# Altium schematic sheet Sheet1.SchDoc
size A4
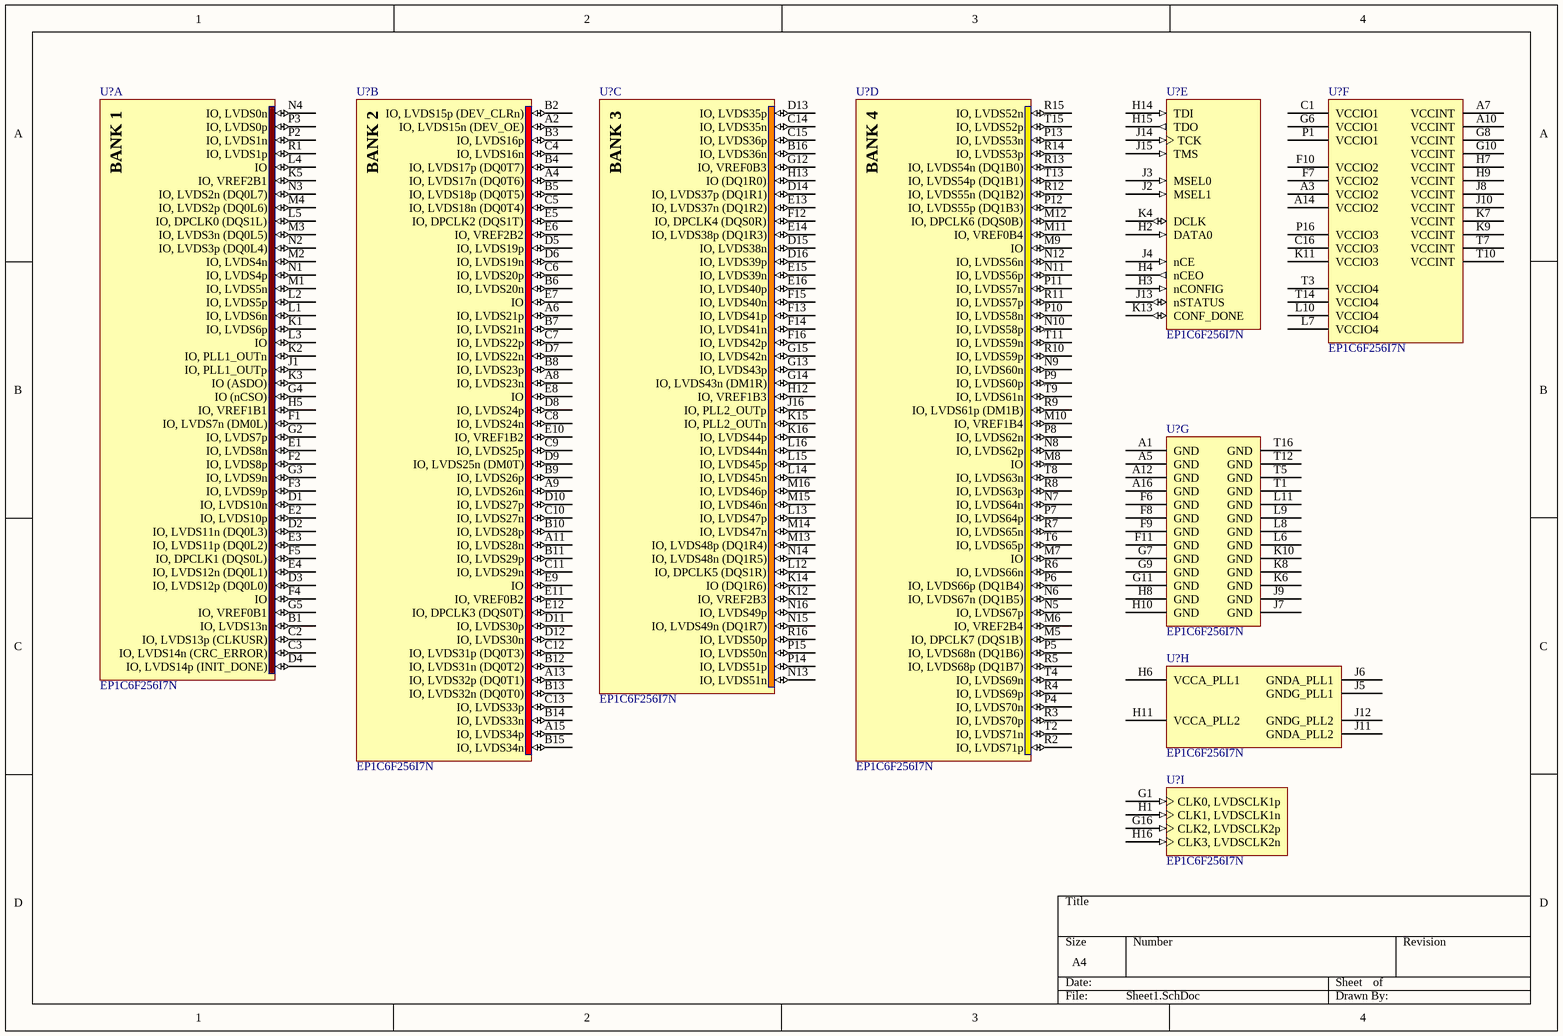
[diagram p0: Sheet1.SchDoc]

## Parts
(Parts that share a designator on the sheet are numbered #1, #2 ... from top to bottom, then left to right.)
U?#1  EP1C6F256I7N  [FBGA256]  (part A of 9)
U?#2  EP1C6F256I7N  [FBGA256]  (part B of 9)
U?#3  EP1C6F256I7N  [FBGA256]  (part C of 9)
U?#4  EP1C6F256I7N  [FBGA256]  (part D of 9)
U?#5  EP1C6F256I7N  [FBGA256]  (part E of 9)
U?#6  EP1C6F256I7N  [FBGA256]  (part F of 9)
U?#7  EP1C6F256I7N  [FBGA256]  (part G of 9)
U?#8  EP1C6F256I7N  [FBGA256]  (part H of 9)
U?#9  EP1C6F256I7N  [FBGA256]  (part I of 9)

## Nets

Not connected (* = marked no-connect by the designer): U?#1 B1(IO,_LVDS13n) C2(IO,_LVDS13p_(CLKUSR)) C3(IO,_LVDS14n_(CRC_ERROR)) D1(IO,_LVDS10n) D2(IO,_LVDS11n_(DQ0L3)) D3(IO,_LVDS12p_(DQ0L0)) D4(IO,_LVDS14p_(INIT_DONE)) E1(IO,_LVDS8n) E2(IO,_LVDS10p) E3(IO,_LVDS11p_(DQ0L2)) E4(IO,_LVDS12n_(DQ0L1)) F1(IO,_LVDS7n_(DM0L)) F2(IO,_LVDS8p) F3(IO,_LVDS9p) F4(IO) F5(IO,_DPCLK1_(DQS0L)) G2(IO,_LVDS7p) G3(IO,_LVDS9n) G4(IO_(nCSO)) G5(IO,_VREF0B1) H5(IO,_VREF1B1) J1(IO,_PLL1_OUTp) K1(IO,_LVDS6p) K2(IO,_PLL1_OUTn) K3(IO_(ASDO)) K5(IO,_VREF2B1) L1(IO,_LVDS6n) L2(IO,_LVDS5p) L3(IO) L4(IO) L5(IO,_DPCLK0_(DQS1L)) M1(IO,_LVDS5n) M2(IO,_LVDS4n) M3(IO,_LVDS3n_(DQ0L5)) M4(IO,_LVDS2p_(DQ0L6)) N1(IO,_LVDS4p) N2(IO,_LVDS3p_(DQ0L4)) N3(IO,_LVDS2n_(DQ0L7)) N4(IO,_LVDS0n) P2(IO,_LVDS1n) P3(IO,_LVDS0p) R1(IO,_LVDS1p); U?#2 A2(IO,_LVDS15n_(DEV_OE)) A4(IO,_LVDS17n_(DQ0T6)) A6(IO,_LVDS21p) A8(IO,_LVDS23n) A9(IO,_LVDS26n) A11(IO,_LVDS28n) A13(IO,_LVDS32p_(DQ0T1)) A15(IO,_LVDS34p) B2(IO,_LVDS15p_(DEV_CLRn)) B3(IO,_LVDS16p) B4(IO,_LVDS17p_(DQ0T7)) B5(IO,_LVDS18p_(DQ0T5)) B6(IO,_LVDS20n) B7(IO,_LVDS21n) B8(IO,_LVDS23p) B9(IO,_LVDS26p) B10(IO,_LVDS28p) B11(IO,_LVDS29p) B12(IO,_LVDS31n_(DQ0T2)) B13(IO,_LVDS32n_(DQ0T0)) B14(IO,_LVDS33n) B15(IO,_LVDS34n) C4(IO,_LVDS16n) C5(IO,_LVDS18n_(DQ0T4)) C6(IO,_LVDS20p) C7(IO,_LVDS22p) C8(IO,_LVDS24n) C9(IO,_LVDS25p) C10(IO,_LVDS27n) C11(IO,_LVDS29n) C12(IO,_LVDS31p_(DQ0T3)) C13(IO,_LVDS33p) D5(IO,_LVDS19p) D6(IO,_LVDS19n) D7(IO,_LVDS22n) D8(IO,_LVDS24p) D9(IO,_LVDS25n_(DM0T)) D10(IO,_LVDS27p) D11(IO,_LVDS30p) D12(IO,_LVDS30n) E5(IO,_DPCLK2_(DQS1T)) E6(IO,_VREF2B2) E7(IO) E8(IO) E9(IO) E10(IO,_VREF1B2) E11(IO,_VREF0B2) E12(IO,_DPCLK3_(DQS0T)); U?#3 B16(IO,_LVDS36n) C14(IO,_LVDS35n) C15(IO,_LVDS36p) D13(IO,_LVDS35p) D14(IO,_LVDS37p_(DQ1R1)) D15(IO,_LVDS38n) D16(IO,_LVDS39p) E13(IO,_LVDS37n_(DQ1R2)) E14(IO,_LVDS38p_(DQ1R3)) E15(IO,_LVDS39n) E16(IO,_LVDS40p) F12(IO,_DPCLK4_(DQS0R)) F13(IO,_LVDS41p) F14(IO,_LVDS41n) F15(IO,_LVDS40n) F16(IO,_LVDS42p) G12(IO,_VREF0B3) G13(IO,_LVDS43p) G14(IO,_LVDS43n_(DM1R)) G15(IO,_LVDS42n) H12(IO,_VREF1B3) H13(IO_(DQ1R0)) J16(IO,_PLL2_OUTp) K12(IO,_VREF2B3) K14(IO_(DQ1R6)) K15(IO,_PLL2_OUTn) K16(IO,_LVDS44p) L12(IO,_DPCLK5_(DQS1R)) L13(IO,_LVDS47p) L14(IO,_LVDS45n) L15(IO,_LVDS45p) L16(IO,_LVDS44n) M13(IO,_LVDS48p_(DQ1R4)) M14(IO,_LVDS47n) M15(IO,_LVDS46n) M16(IO,_LVDS46p) N13(IO,_LVDS51n) N14(IO,_LVDS48n_(DQ1R5)) N15(IO,_LVDS49n_(DQ1R7)) N16(IO,_LVDS49p) P14(IO,_LVDS51p) P15(IO,_LVDS50n) R16(IO,_LVDS50p); U?#4 M5(IO,_DPCLK7_(DQS1B)) M6(IO,_VREF2B4) M7(IO) M8(IO) M9(IO) M10(IO,_VREF1B4) M11(IO,_VREF0B4) M12(IO,_DPCLK6_(DQS0B)) N5(IO,_LVDS67p) N6(IO,_LVDS67n_(DQ1B5)) N7(IO,_LVDS64n) N8(IO,_LVDS62p) N9(IO,_LVDS60n) N10(IO,_LVDS58p) N11(IO,_LVDS56p) N12(IO,_LVDS56n) P4(IO,_LVDS70n) P5(IO,_LVDS68n_(DQ1B6)) P6(IO,_LVDS66p_(DQ1B4)) P7(IO,_LVDS64p) P8(IO,_LVDS62n) P9(IO,_LVDS60p) P10(IO,_LVDS58n) P11(IO,_LVDS57n) P12(IO,_LVDS55p_(DQ1B3)) P13(IO,_LVDS53n) R2(IO,_LVDS71p) R3(IO,_LVDS70p) R4(IO,_LVDS69p) R5(IO,_LVDS68p_(DQ1B7)) R6(IO,_LVDS66n) R7(IO,_LVDS65n) R8(IO,_LVDS63p) R9(IO,_LVDS61p_(DM1B)) R10(IO,_LVDS59p) R11(IO,_LVDS57p) R12(IO,_LVDS55n_(DQ1B2)) R13(IO,_LVDS54n_(DQ1B0)) R14(IO,_LVDS53p) R15(IO,_LVDS52n) T2(IO,_LVDS71n) T4(IO,_LVDS69n) T6(IO,_LVDS65p) T8(IO,_LVDS63n) T9(IO,_LVDS61n) T11(IO,_LVDS59n) T13(IO,_LVDS54p_(DQ1B1)) T15(IO,_LVDS52p); U?#5 H2(DATA0) H3(nCONFIG) H4(nCEO) H14(TDI) H15(TDO) J2(MSEL1) J3(MSEL0) J4(nCE) J13(nSTATUS) J14(TCK) J15(TMS) K4(DCLK) K13(CONF_DONE); U?#6 A3(VCCIO2) A7(VCCINT) A10(VCCINT) A14(VCCIO2) C1(VCCIO1) C16(VCCIO3) F7(VCCIO2) F10(VCCIO2) G6(VCCIO1) G8(VCCINT) G10(VCCINT) H7(VCCINT) H9(VCCINT) J8(VCCINT) J10(VCCINT) K7(VCCINT) K9(VCCINT) K11(VCCIO3) L7(VCCIO4) L10(VCCIO4) P1(VCCIO1) P16(VCCIO3) T3(VCCIO4) T7(VCCINT) T10(VCCINT) T14(VCCIO4); U?#7 A1(GND) A5(GND) A12(GND) A16(GND) F6(GND) F8(GND) F9(GND) F11(GND) G7(GND) G9(GND) G11(GND) H8(GND) H10(GND) J7(GND) J9(GND) K6(GND) K8(GND) K10(GND) L6(GND) L8(GND) L9(GND) L11(GND) T1(GND) T5(GND) T12(GND) T16(GND); U?#8 H6(VCCA_PLL1) H11(VCCA_PLL2) J5(GNDG_PLL1) J6(GNDA_PLL1) J11(GNDA_PLL2) J12(GNDG_PLL2); U?#9 G1(CLK0,_LVDSCLK1p) G16(CLK2,_LVDSCLK2p) H1(CLK1,_LVDSCLK1n) H16(CLK3,_LVDSCLK2n)

## Notes on the sheet
- (in symbol EP1C6F256I7N, part A) BANK 1
- (in symbol EP1C6F256I7N, part B) BANK 2
- (in symbol EP1C6F256I7N, part C) BANK 3
- (in symbol EP1C6F256I7N, part D) BANK 4

## Library data of the parts
U?#1-U?#9 = EP1C6F256I7N: Cyclone Family, 1.5V FPGA, 185 I/O Pins, 2 x PLLs, Industrial Grade, Speed Grade 7, Pb-Free; Published: 18-Aug-2005; LatestRevisionDate: 13-Apr-2006; LatestRevisionNote: Pin C3 name fix, IPC-7351 Footprint Added.; DatasheetVersion: ver2.4, May-2008; PackageVersion: ver16.0, Dec-2009; PackageReference: FBGA256; Publisher: Altium Limited; PackageDescription: 256-Ball FineLine Ball Grid Array (FBGA256) - Option 1 - Wire Bond; Supplier 1: Digi-Key; Supplier Part Number 1: 544-1810-ND; Supplier 2: Farnell; Supplier Part Number 2: 1453478; Code_JEDEC: MS-034-AAF-1; Code_IPC: BGA100P16X16-256; ComponentLink1Description: Manufacturer Link; ComponentLink1URL: http://www.altera.com/products/devices/cyclone/cyc-index.jsp; ComponentLink2Description: Handbook; ComponentLink2URL: http://www.altera.com/literature/hb/cyc/cyc_c5v1.pdf; ComponentLink3Description: Packaging Specification; ComponentLink3URL: http://www.altera.com/literature/ds/dspkg.pdf